# Altium project test2.PrjPcb
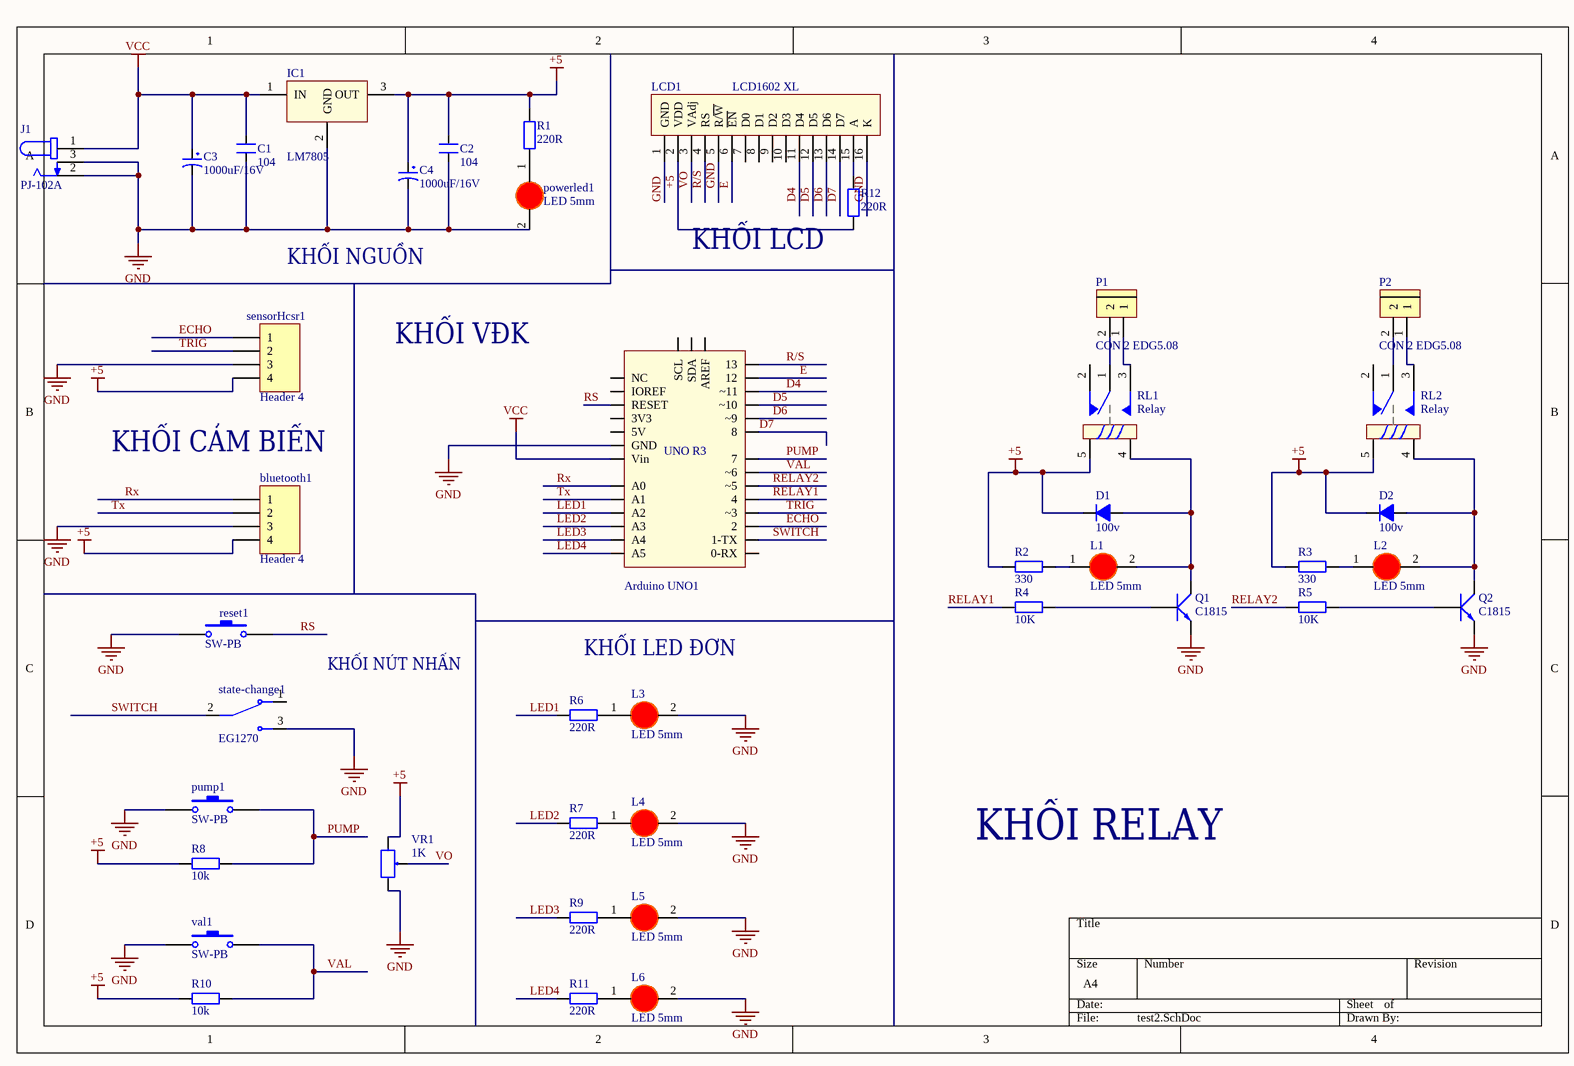
[diagram p0: test2.SchDoc]
1 sheet, 42 parts. Net scope: global (net labels, ports and power ports of the same name join across sheets).
Board file: PCB2.PcbDoc

## Sheet test2.SchDoc
size A4; SheetNumber: 1; SheetTotal: 1

### Parts
Arduino_UNO1  Arduino Uno R3  [Arduino UNO R3]  (value not drawn)
bluetooth1  Header 4  [HDR1X4]
C1  104  [CN2]
C2  104  [CN2]
C3  1000uF/16V  [CP1.5/3.4]
C4  1000uF/16V  [CP1.5/3.4]
D1  100v  [DIODE 1A]
D2  100v  [DIODE 1A]
IC1  LM7805  [QTO-220]
J1  PJ-102A  [CUI_PJ-102A]
L1  LED 5mm  [LED-5MM-RED]
L2  LED 5mm  [LED-5MM-RED]
L3  LED 5mm  [LED-5MM-RED]
L4  LED 5mm  [LED-5MM-RED]
L5  LED 5mm  [LED-5MM-RED]
L6  LED 5mm  [LED-5MM-RED]
LCD1  LCD1602 XL  [LCD1602 with Jump]
P1  CON 2 EDG5.08  [CON 2 2EDG5.08]
P2  CON 2 EDG5.08  [CON 2 2EDG5.08]
powerled1  LED 5mm  [LED-5MM-RED]
pump1  SW-PB  [SPST-2]
Q1  C1815  [TO92]
Q2  C1815  [TO92]
R1  220R  [tro vach 1/4w]
R2  330  [tro vach 1/4w]
R3  330  [tro vach 1/4w]
R4  10K  [tro vach 1/4w]
R5  10K  [tro vach 1/4w]
R6  220R  [tro vach 1/4w]
R7  220R  [tro vach 1/4w]
R8  10k  [tro vach 1/4w]
R9  220R  [tro vach 1/4w]
R10  10k  [tro vach 1/4w]
R11  220R  [tro vach 1/4w]
R12  220R  [tro vach 1/4w]
reset1  SW-PB  [SPST-2]
RL1  Relay  [Relay 5 Chan SRD]
RL2  Relay  [Relay 5 Chan SRD]
sensorHcsr1  Header 4  [HDR1X4]
state-change1  EG1270  [SW_EG1270]
val1  SW-PB  [SPST-2]
VR1  1K  [Bien Tro Vi Chinh Dung]

### Nets
+5: bluetooth1.4 C2.2 C4.1 D1.2(K) D2.2(K) IC1.3(OUT) LCD1.2(VDD) R1.2 R2.1 R3.1 R8.1 R10.1 R12.1 RL1.5 RL2.5 sensorHcsr1.4 VR1.1
GND: Arduino_UNO1.GND bluetooth1.3 C1.1 C2.1 C3.2 C4.2 IC1.2(GND) J1.2 J1.3 L3.2(K) L4.2(K) L5.2(K) L6.2(K) LCD1.1(GND) LCD1.5(R/~{W}) LCD1.16(K) powerled1.2(K) pump1.1 Q1.1(E) Q2.1(E) reset1.1 sensorHcsr1.3 state-change1.3 val1.1 VR1.3
VCC: Arduino_UNO1.Vin C1.2 C3.1 IC1.1(IN) J1.1
D4: Arduino_UNO1.~11 LCD1.11(D4)
D5: Arduino_UNO1.~10 LCD1.12(D5)
D6: Arduino_UNO1.~9 LCD1.13(D6)
D7: Arduino_UNO1.8 LCD1.14(D7)
E: Arduino_UNO1.12 LCD1.6(~{EN})
ECHO: Arduino_UNO1.2 sensorHcsr1.1
LED1: Arduino_UNO1.A2 R6.2
LED2: Arduino_UNO1.A3 R7.2
LED3: Arduino_UNO1.A4 R9.2
LED4: Arduino_UNO1.A5 R11.2
PUMP: Arduino_UNO1.7 pump1.2 R8.2
R/S: Arduino_UNO1.13 LCD1.4(RS)
RELAY1: Arduino_UNO1.4 R4.1
RELAY2: Arduino_UNO1.~5 R5.1
RS: Arduino_UNO1.RESET reset1.2
Rx: Arduino_UNO1.A0 bluetooth1.1
SWITCH: Arduino_UNO1.1-TX state-change1.2
TRIG: Arduino_UNO1.~3 sensorHcsr1.2
Tx: Arduino_UNO1.A1 bluetooth1.2
VAL: Arduino_UNO1.~6 R10.2 val1.2
VO: LCD1.3(VAdj) VR1.2
NetD1_1: D1.1(A) L1.2(K) Q1.2(C) RL1.4
NetD2_1: D2.1(A) L2.2(K) Q2.2(C) RL2.4
NetL1_1: L1.1(A) R2.2
NetL2_1: L2.1(A) R3.2
NetL3_1: L3.1(A) R6.1
NetL4_1: L4.1(A) R7.1
NetL5_1: L5.1(A) R9.1
NetL6_1: L6.1(A) R11.1
NetLCD1_15: LCD1.15(A) R12.2
NetP1_1: P1.1 RL1.3
NetP1_2: P1.2 RL1.1
NetP2_1: P2.1 RL2.3
NetP2_2: P2.2 RL2.1
Netpowerled1_1: powerled1.1(A) R1.1
NetQ1_3: Q1.3(B) R4.2
NetQ2_3: Q2.3(B) R5.2

Not connected (* = marked no-connect by the designer): Arduino_UNO1 0-RX 3V3 5V AREF IOREF NC SCL SDA; LCD1 7(D0) 8(D1) 9(D2) 10(D3); RL1 2; RL2 2; state-change1 1

### Notes on the sheet
- KHỐI NGUỒN
- (near R12) KHỐI LCD
- KHỐI VĐK
- KHỐI CẢM BIẾN
- KHỐI NÚT NHẤN
- KHỐI LED ĐƠN
- KHỐI RELAY
- (in symbol Arduino Uno R3) UNO R3

### Library data of the parts
Arduino_UNO1 = Arduino Uno R3: Value: Cau 1A
bluetooth1 sensorHcsr1 = Header 4: Header, 4-Pin; LatestRevisionDate: 17-Jul-2002; LatestRevisionNote: Re-released for DXP Platform.; Publisher: Altium Limited
C1 C2 = CN2: Cap np 104 => 105pF; Value: 0.1uF
C3 C4 = CP4: Cap 1000uF/16V - 220uF/50V; Description 5: 4,7uF>10uF/250V_3,3uF>10uF/400V - 2,2uF>4,7uF/450V; Description 1: 2200uF-3300uF/6,3V - 1000uF-2200uF/10V; Description 2: 1000uF/16V - 470uF => 1000uF/25V - 100uF/100V; Description 3: 330uF>470uF/35V_220uF>470uF/50V_10uF>22uF/250V; Description 4: 220uF => 330uF/63V - 10uF =>33uF/160 - 200V; Value: 1000uF/16V
D1 D2 = Diode 1N4007: Cắm; Ten_Linh_Kien: Diode 1N4007 1A (DIP); Don_Vi: Con; Ma_Hang: MH001063; Ghi Chu: *; Kieu_Chan: *; Chung_Loai: Cắm
IC1 = LM78xx: On ap +, from + 5 to + 24VDC; Value: LM7805
J1 = PJ-102A: 2.0 x 6.5 mm, 2.5 A, Horizontal, Through Hole, Tapered Pins, Dc Power Jack Connector; MF: CUI Devices; Price: None; Availability: In Stock; Package: None; MP: PJ-102A; CUI_purchase_URL: https://www.cuidevices.com/product/interconnect/connectors/dc-power-connectors/jacks/pj-102a?utm_source=snapeda.com&utm_medium=referral&utm_campaign=snapedaBOM; Value: *; SnapEDA_Link: https://www.snapeda.com/parts/PJ-102A/CUI+Devices/view-part/?ref=snap; Purchase-URL: https://pricing.snapeda.com/search/part/PJ-102A/?ref=eda; Check_prices: https://www.snapeda.com/parts/PJ-102A/CUI+Devices/view-part/?ref=eda
L1-L6 powerled1 = LED 5mm Do: Cắm; Don_Vi: Con; Ma_Hang: MH008967; Ten_Linh_Kien: Led 5MM Phủ Đỏ (1000c); Ghi_Chu: *; Kieu_Chan: *; Chung_Loai: Cắm
LCD1 = LCD1602 XL: LCD 1602 Xanh Lá; Ten: Màn hình LCD 1602 Xanh Lá; Ma_Hang: 67HZ; NCC: NSHOP; CHIP: HD44780
P1 P2 = CON 2 EDG5.08: Cắm; Ten_Linh_Kien: CON 2 2EDG5.08-2P 5.08MM ( Xanh Cong); Ma_Hang: MH000759; Ghi_Chu: *; Don_Vi: Con; Kieu_Chan: *; Chung_Loai: Cắm
pump1 reset1 val1 = SW-PB: Switch; Published: 24-Mar-1999; LatestRevisionDate: 17-Jul-2002; LatestRevisionNote: Re-released for DXP Platform.; PackageReference: SPST-2; Publisher: Altium Limited; PackageDescription: Switch; 2 Leads
Q1 Q2 = C1815: NPN transistor; Value: C9014
R1-R7 R9 R11 R12 = Tro Vach 1/4W 5% 220R: Cắm; Don_Vi: Con; So_Chan: 2; Ten_Linh_Kien: Trở Vạch 1/4w 5% 220R; Ma_Hang: MH007300; Chung_Loai: Cắm; Kieu_Chan: *
R8 R10 = Tro Vach 1/4W 5% 1k: Cắm; Don_Vi: Con; So_Chan: 2; Ten_Linh_Kien: Trở Vạch 1/4w 5% 1k; Ma_Hang: MH007390; Chung_Loai: Cắm; Kieu_Chan: *
RL1 RL2 = Relay 5 Chan SRD: Relay 5 Chan; Ma_Hang: MH009374; Ten: Relay 5V10A SRD-05VDC-SL-C Chính Hãng
state-change1 = EG1270: Slide Switch SPDT Through Hole, Right Angle; MF: E-Switch; Availability: In Stock; Check_prices: https://www.snapeda.com/parts/EG1270/E-Switch/view-part/?ref=eda; SnapEDA_Link: https://www.snapeda.com/parts/EG1270/E-Switch/view-part/?ref=snap; Purchase-URL: https://pricing.snapeda.com/search/part/EG1270/?ref=eda; Package: None; MP: EG1270; Value: *; Price: None
VR1 = Bien Tro Tinh Chinh 1K Dung: Cắm; Don_Vi: Con; Ten_Linh_Kien: Biến Trở VR 102-1K 3296W; Ma_Hang: MH003234; Kieu_Chan: *; Chung_Loai: Cắm